# Altium schematic sheet LoadSwitch.SchDoc
size A; SheetNumber: 2; SheetTotal: 4
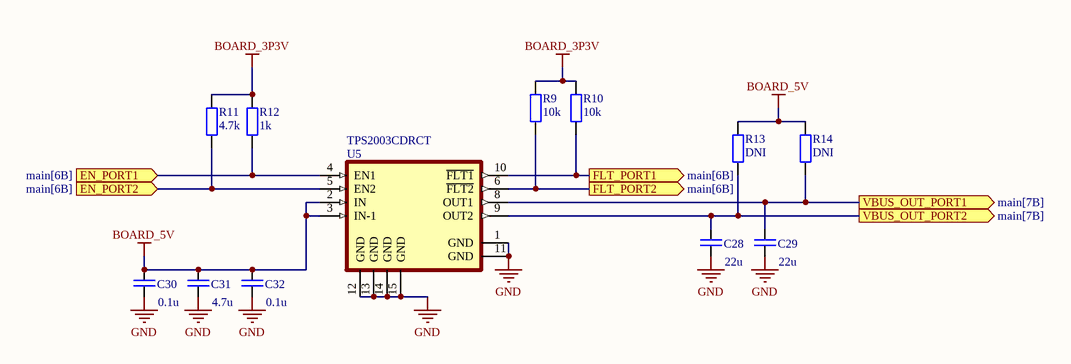
[diagram p0: LoadSwitch.SchDoc]

## Parts
C28  value 22u  [CAP_0603_N]  (hidden comment: comment)
C29  value 22u  [CAP_0603_N]  (hidden comment: comment)
C30  value 0.1u  [CAP_0603_N]  (hidden comment: comment)
C31  value 4.7u  [CAP_0603_N]  (hidden comment: comment)
C32  value 0.1u  [CAP_0603_N]  (hidden comment: comment)
R9  value 10k  [SMD_0603_N]  (hidden comment: comment)
R10  value 10k  [SMD_0603_N]  (hidden comment: comment)
R11  value 4.7k  [SMD_0603_N]  (hidden comment: comment)
R12  value 1k  [SMD_0603_N]  (hidden comment: comment)
R13  value DNI  [SMD_0603_N]  (hidden comment: comment)
R14  value DNI  [SMD_0603_N]  (hidden comment: comment)
U5  TPS2003CDRCT  [VREG_V62/16624-01YE]

## Ports
EN_PORT1 (in, see main[6B]), EN_PORT2 (in, see main[6B]), FLT_PORT1 (out, see main[6B]), FLT_PORT2 (out, see main[6B]), VBUS_OUT_PORT1 (out, see main[7B]), VBUS_OUT_PORT2 (out, see main[7B])

## Nets
BOARD_3P3V: R9.2 R10.2 R11.2 R12.2
BOARD_5V: C30.1 C31.1 C32.1 R13.2 R14.2 U5.2(IN) U5.3(IN-1)
GND: C28.2 C29.2 C30.2 C31.2 C32.2 U5.1(GND) U5.11(GND) U5.12(GND) U5.13(GND) U5.14(GND) U5.15(GND)
EN_PORT1: R12.1 U5.4(EN1) ; port EN_PORT1
EN_PORT2: R11.1 U5.5(EN2) ; port EN_PORT2
FLT_PORT1: R10.1 U5.10(~{FLT1}) ; port FLT_PORT1
FLT_PORT2: R9.1 U5.6(~{FLT2}) ; port FLT_PORT2
VBUS_OUT_PORT1: C29.1 R14.1 U5.8(OUT1) ; port VBUS_OUT_PORT1
VBUS_OUT_PORT2: C28.1 R13.1 U5.9(OUT2) ; port VBUS_OUT_PORT2

## Library data of the parts
C28-C32 = Capacitor non-polarized
R9-R14 = Resistor
U5 = TPS2003CDRCT: Package: None; Price: None; Value: *; MP: TPS2003CDRCT; Availability: Unavailable